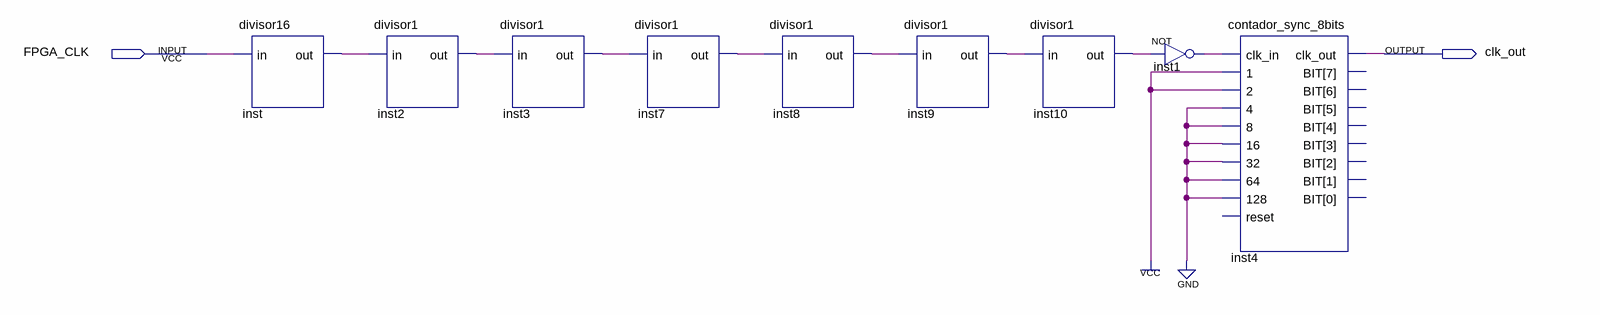
[diagram p0: schematic sheet]
// Quartus schematic freq_2hz.bdf as structural Verilog: 9 symbols, 2 pins
module freq_2hz (
  input  FPGA_CLK,
  output clk_out
);

  wire inst1_out, inst2_out, inst3_out, inst7_out, inst8_out, inst9_out, inst10_out, inst_out;

  divisor16 inst (.in(FPGA_CLK), .out(inst_out));
  divisor1 inst2 (.in(inst_out), .out(inst2_out));
  divisor1 inst3 (.in(inst2_out), .out(inst3_out));
  divisor1 inst7 (.in(inst3_out), .out(inst7_out));
  divisor1 inst8 (.in(inst7_out), .out(inst8_out));
  divisor1 inst9 (.in(inst8_out), .out(inst9_out));
  divisor1 inst10 (.in(inst9_out), .out(inst10_out));
  not inst1 (inst1_out, inst10_out);
  contador_sync_8bits inst4 (
    .clk_in(inst1_out), .\1 (1'b1), .\2 (1'b1), .\4 (1'b0), .\8 (1'b0), .\16 (1'b0), .\32 (1'b0),
    .\64 (1'b0), .\128 (1'b0), .clk_out(clk_out));  // open: reset, BIT
endmodule
